# Altium schematic sheet ad.SchDoc
size A1
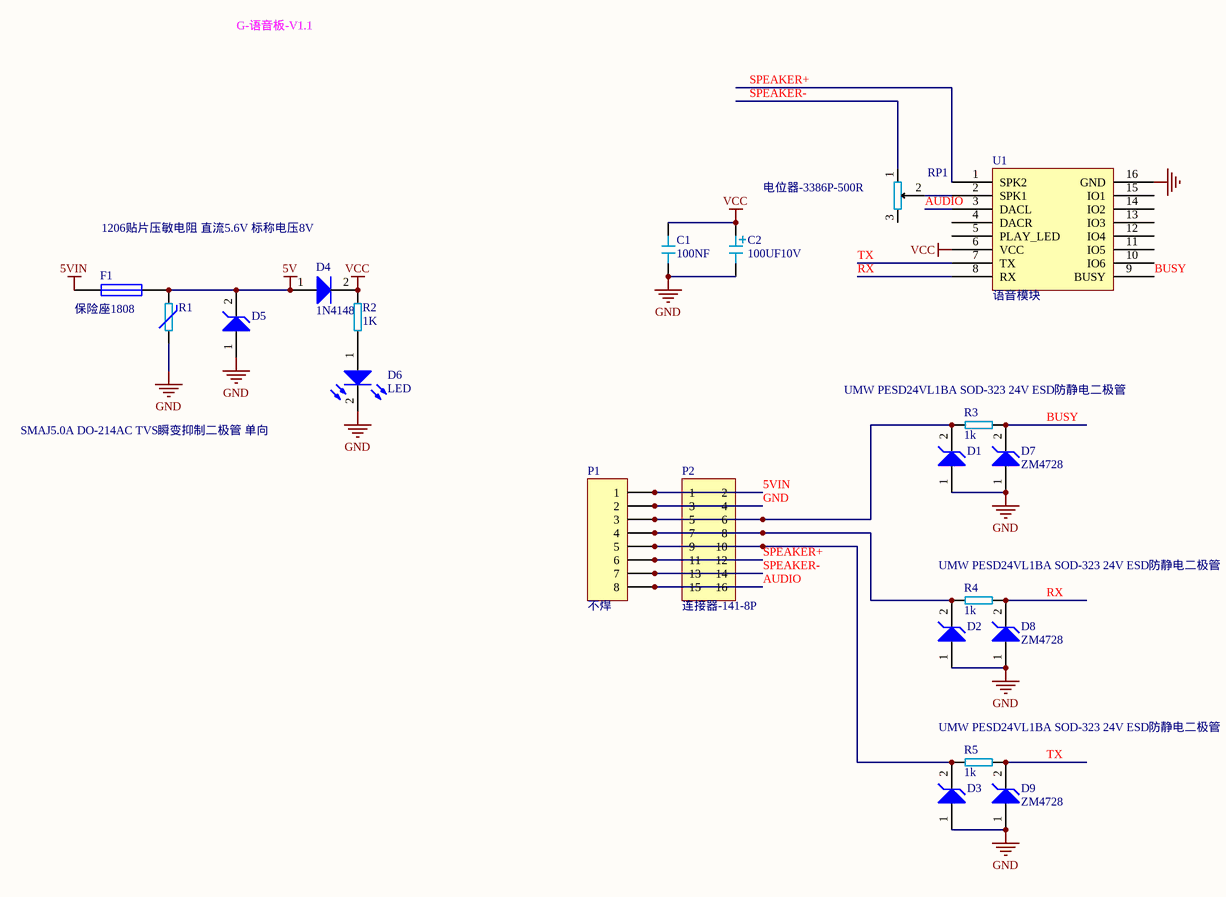
[diagram p0: ad.SchDoc]

## Parts
C1  100NF  [C0603]
C2  100UF10V  [C3528+]
D1  UMW PESD24VL1BA SOD-323 24V ESD防静电二极管  [SOD323]
D2  UMW PESD24VL1BA SOD-323 24V ESD防静电二极管  [SOD323]
D3  UMW PESD24VL1BA SOD-323 24V ESD防静电二极管  [SOD323]
D4  1N4148  [SOD123]
D5  SMAJ5.0A DO-214AC TVS瞬变抑制二极管 单向  [SMA]
D6  LED  [LED0603]
D7  ZM4728  [D1206]
D8  ZM4728  [D1206]
D9  ZM4728  [D1206]
F1  保险座1808  [F1808-ZUO]
P1  不焊  [SIP8]
P2  连接器-141-8P  [141V-8P]
R1  1206贴片压敏电阻 直流5.6V 标称电压8V  [R1206]
R2  1K  [R0603]
R3  1k  [R0603]
R4  1k  [R0603]
R5  1k  [R0603]
RP1  电位器-3386P-500R  [RR-3386]
U1  语音模块  [YYMK]

## Nets
5V: D4.1(A) D5.2 F1.2 R1.2
5VIN: F1.1 P1.1 P2.1 P2.2
GND: C1.1 C2.2 D1.1 D2.1 D3.1 D5.1 D6.2(K) D7.1 D8.1 D9.1 P1.2 P2.3 P2.4 R1.1 U1.16(GND)
VCC: C1.2 C2.1 D4.2(K) R2.2 U1.6(VCC)
AUDIO: P1.8 P2.15 P2.16 U1.3(DACL)
BUSY: D7.2 R3.1 U1.9(BUSY)
RX: D8.2 R4.1 U1.8(RX)
SPEAKER+: P1.6 P2.11 P2.12 U1.1(SPK2)
SPEAKER-: P1.7 P2.13 P2.14 RP1.1
TX: D9.2 R5.1 U1.7(TX)
NetD1_2: D1.2 P1.3 P2.5 P2.6 R3.2
NetD2_2: D2.2 P1.4 P2.7 P2.8 R4.2
NetD3_2: D3.2 P1.5 P2.9 P2.10 R5.2
NetD6_1: D6.1(A) R2.1
NetRP1_2: RP1.2 U1.2(SPK1)

Not connected (* = marked no-connect by the designer): RP1 3; U1 4(DACR) 5(PLAY_LED) 10(IO6) 11(IO5) 12(IO4) 13(IO3) 14(IO2) 15(IO1)

## Notes on the sheet
- Labels drawn without touching a wire or pin: G-语音板-V1.1

## Library data of the parts
C1 = C0603: 贴片电容
C2 = C+: 铝电解电容
D1-D3 D5 = TVS-SMA: TVS; Published: 8-Jun-2000; LatestRevisionDate: 17-Jul-2002; LatestRevisionNote: Re-released for DXP Platform.; DatasheetVersion: 1997; PackageReference: DO-35; Publisher: Altium Limited; PackageDescription: Diode, Axial; Body 3.8 x 1.9 mm (LxDia. max), Lead Dia. 0.53 mm (max); Code_JEDEC: DO-204-AH; ComponentLink1Description: Manufacturer Link; ComponentLink1URL: http://www.fairchildsemi.com/; ComponentLink2Description: Datasheet; ComponentLink2URL: http://www.fairchildsemi.com/ds/1N%2F1N4448.pdf
D4 = DD: 二极管; Published: 8-Jun-2000; LatestRevisionDate: 17-Jul-2002; LatestRevisionNote: Re-released for DXP Platform.; DatasheetVersion: 1997; PackageReference: DO-35; Publisher: Altium Limited; PackageDescription: Diode, Axial; Body 3.8 x 1.9 mm (LxDia. max), Lead Dia. 0.53 mm (max); Code_JEDEC: DO-204-AH; ComponentLink1Description: Manufacturer Link; ComponentLink1URL: http://www.fairchildsemi.com/; ComponentLink2Description: Datasheet; ComponentLink2URL: http://www.fairchildsemi.com/ds/1N%2F1N4448.pdf
D6 = LED0603: Published: 8-Jun-2000; LatestRevisionDate: 08-Jul-2005; LatestRevisionNote: Mech Layer 1 removed.; PackageReference: LED-0; Publisher: Altium Limited; PackageDescription: LED; 2 Leads
D7-D9 = TVS-SMA: 稳压管; Published: 8-Jun-2000; LatestRevisionDate: 17-Jul-2002; LatestRevisionNote: Re-released for DXP Platform.; DatasheetVersion: 1997; PackageReference: DO-35; Publisher: Altium Limited; PackageDescription: Diode, Axial; Body 3.8 x 1.9 mm (LxDia. max), Lead Dia. 0.53 mm (max); Code_JEDEC: DO-204-AH; ComponentLink1Description: Manufacturer Link; ComponentLink1URL: http://www.fairchildsemi.com/; ComponentLink2Description: Datasheet; ComponentLink2URL: http://www.fairchildsemi.com/ds/1N%2F1N4448.pdf
F1 = Fuse0805: 自恢复保险; Published: 8-Jun-2000; LatestRevisionDate: 17-Jul-2002; LatestRevisionNote: Re-released for DXP Platform.; PackageReference: PIN-W2/E2.8; Publisher: Altium Limited; PackageDescription: Thru-Hole; 2 Leads
P1 = SIP8: 连接器; LatestRevisionDate: 17-Jul-2002; LatestRevisionNote: Re-released for DXP Platform.; Publisher: Altium Limited
P2 = DIC16: 连接器; LatestRevisionDate: 17-Jul-2002; LatestRevisionNote: Re-released for DXP Platform.; Publisher: Altium Limited
R1 = RV: 压敏电阻
R2-R5 = R-0603: 贴片电阻
RP1 = RR: 电位器
U1 = YYMK